# EAGLE schematic tape-sensor (EAGLE 7.2.0)
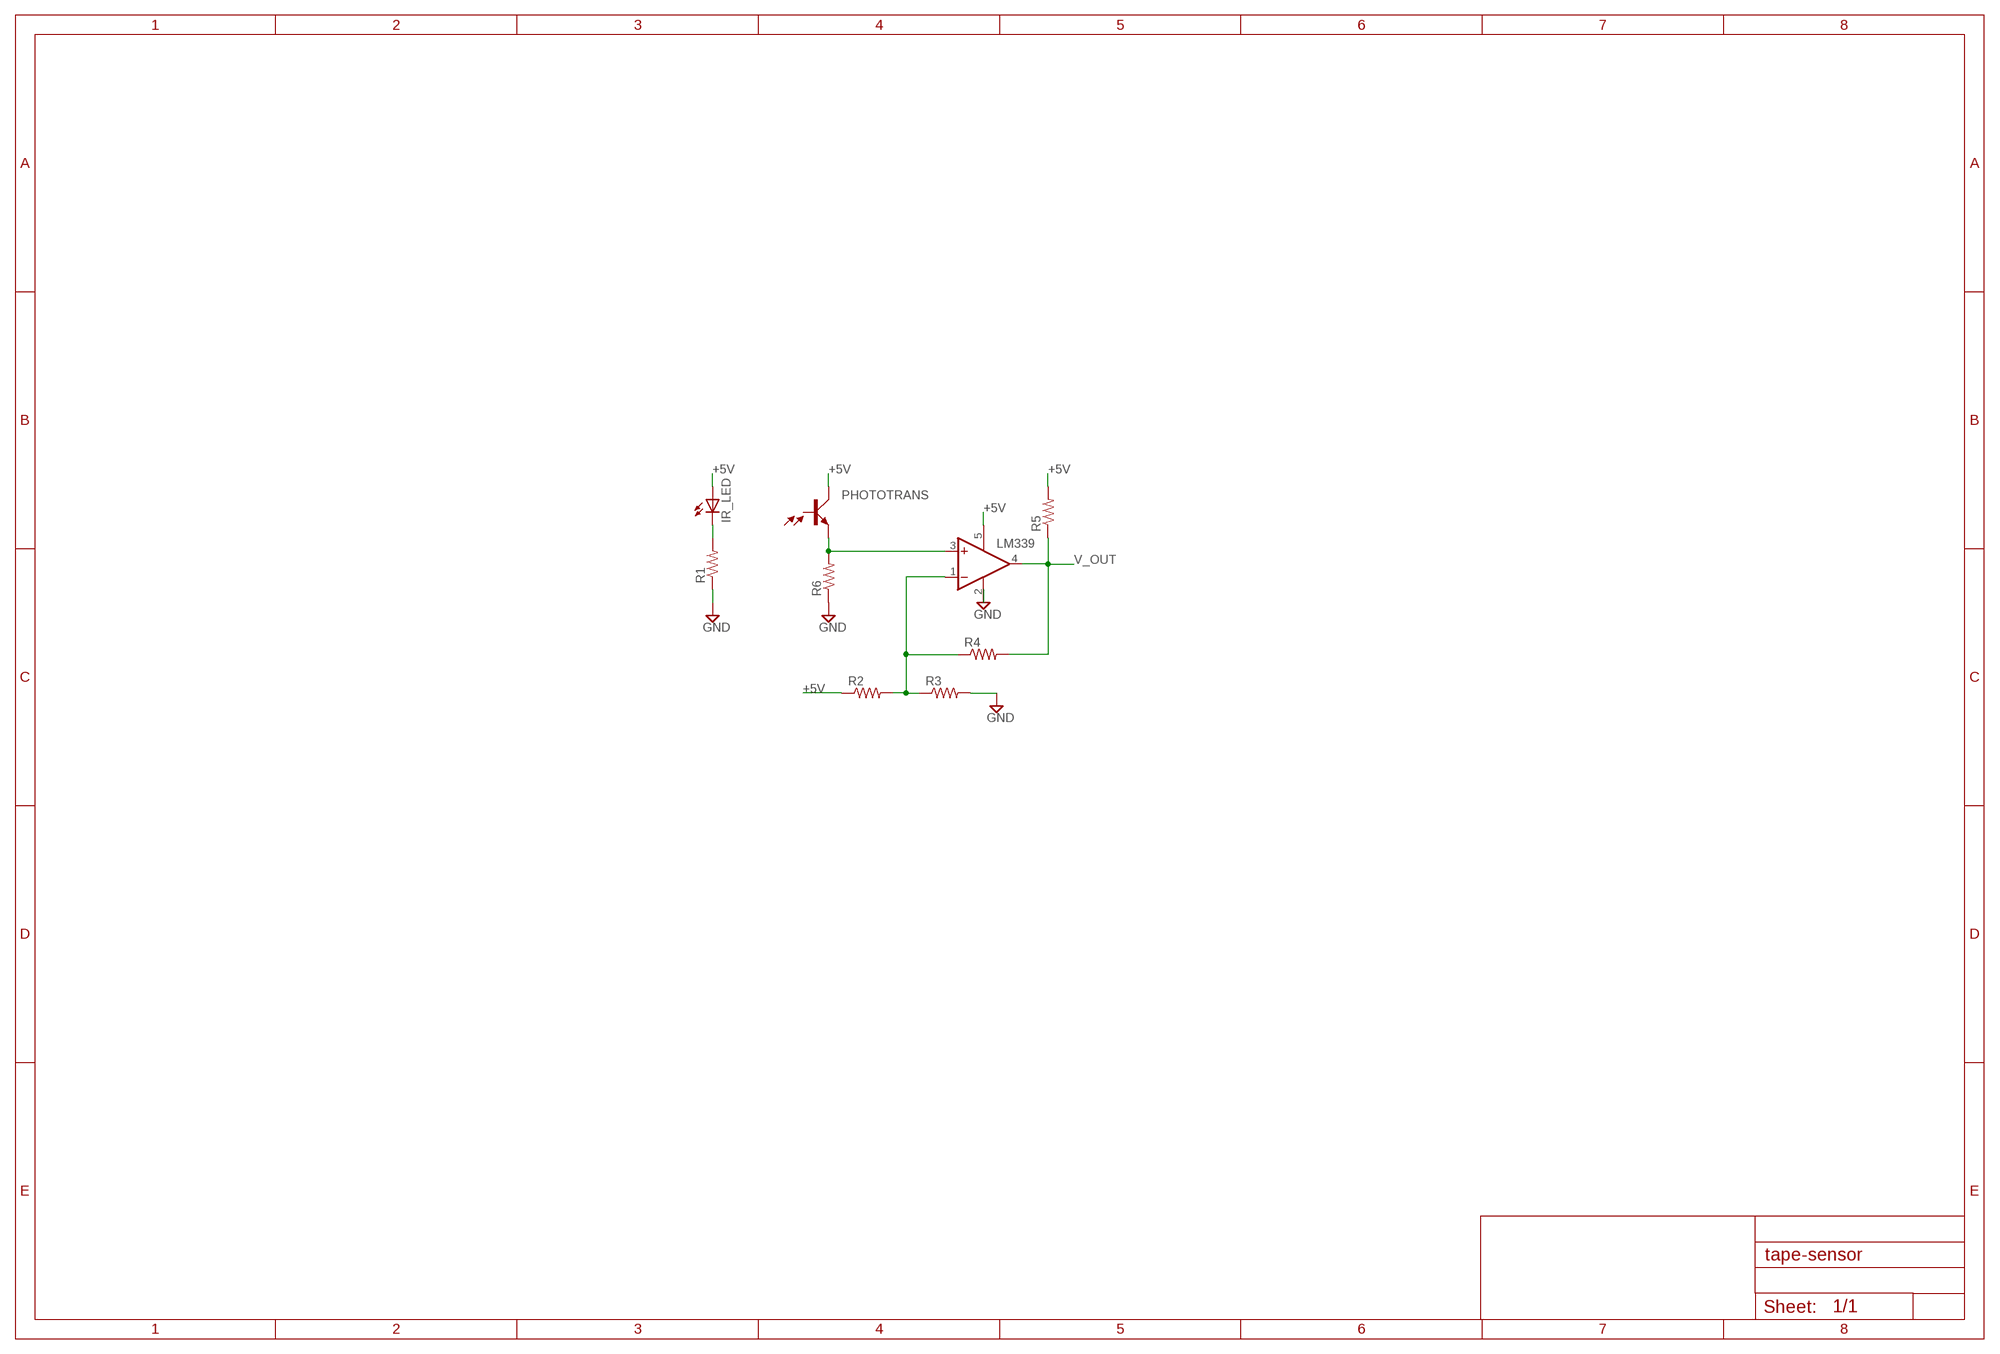
[diagram p0: schematic, sheet 1]

## Parts
IR_LED  SFH482  [SFH482]
LM339  TL331  [DBV-R-PDSO-G5]
PHOTOTRANS  SFH303  [SFH303]
R1  R-US_0204/2V  [0204V]
R2  R-US_0204/2V  [0204V]
R3  R-US_0204/2V  [0204V]
R4  R-US_0204/2V  [0204V]
R5  R-US_0204/2V  [0204V]
R6  R-US_0204/2V  [0204V]

## Nets
+5V: IR_LED.A LM339.5(V+) PHOTOTRANS.2(C) R2.1 R5.2
GND: LM339.2(GND) R1.1 R3.2 R6.1
N$1: LM339.3(+IN) PHOTOTRANS.1(E) R6.2
N$4: LM339.1(-IN) R2.2 R3.1 R4.1
N$7: IR_LED.K(C) R1.2
V_OUT: LM339.4(OUT) R4.2 R5.1
Unconnected: PHOTOTRANS.3(B)

## Library data of the parts
IR_LED = led:SFH482: IR LED infrared emitting diode, Infineon
LM339 = linear:TL331: SINGLE DIFFERENTIAL COMPARATOR Source: Data sheet <http://www.ti.com/lit/ds/symlink/tl331-q1.pdf>
PHOTOTRANS = opto-trans-siemens:SFH303: Silicium NPN Phototransistor Source: Siemens; OC_FARNELL: unknown; OC_NEWARK: unknown
R1-R6 = resistor:R-US_: RESISTOR, American symbol